# EAGLE schematic overview (EAGLE 6.4)
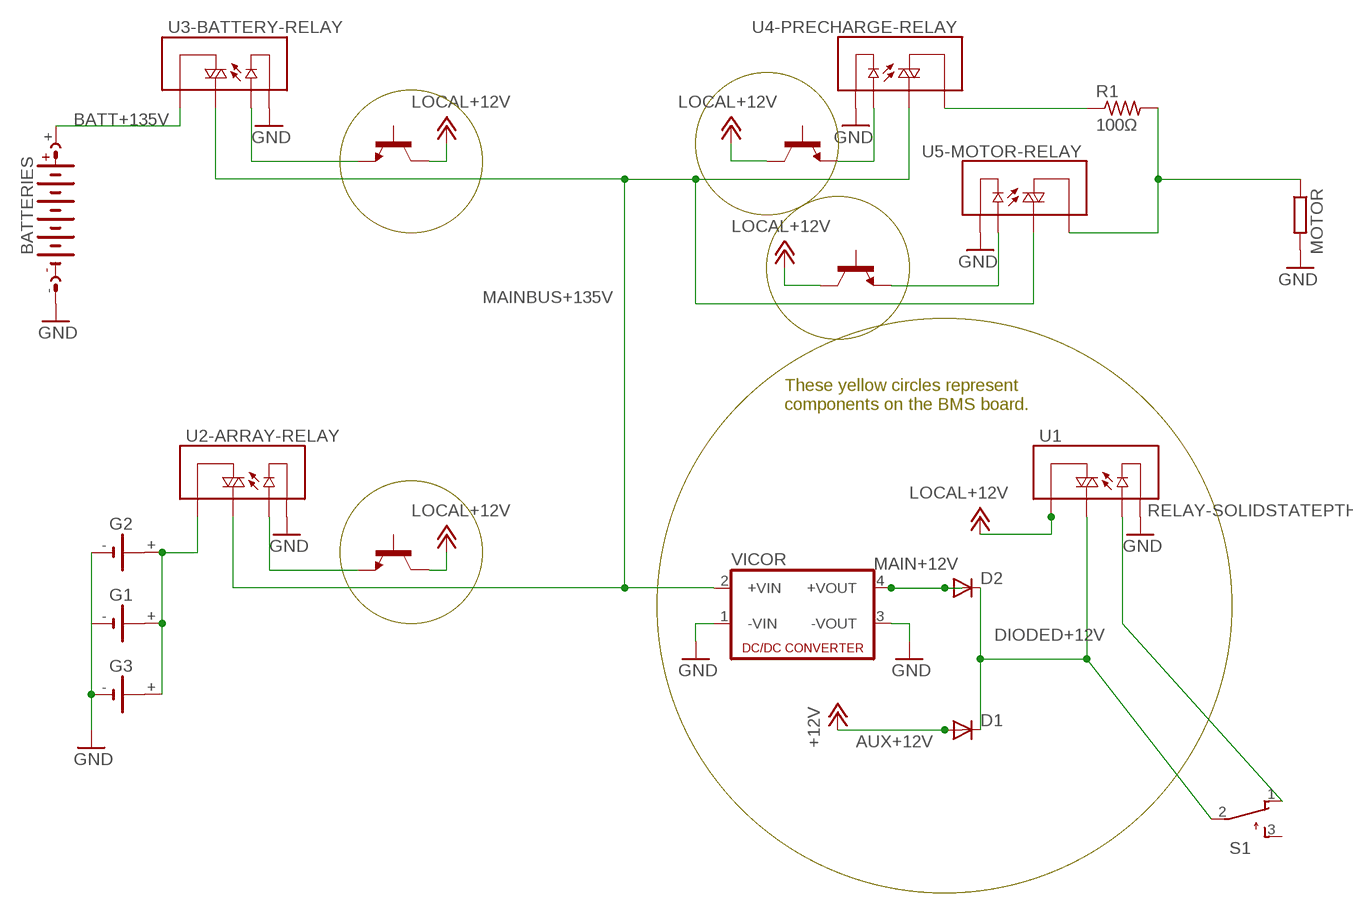
[diagram p0: schematic, sheet 1]

## Parts
BATTERIES  AB9V  [AB9V]
D1  BY550  [DO27-15]
D2  BY550  [DO27-15]
G1  CR03N  [CR03N]
G2  CR03N  [CR03N]
G3  CR03N  [CR03N]
MOTOR  R-EU_0204/7  [0204/7]
R1  100Ω  R-US_0617/22  [0617/22]
S1  TL32PO  [TL3XPO]
T1  2N1613  [TO5]
T2  2N1613  [TO5]
T3  2N1613  [TO5]
T4  2N1613  [TO5]
U1  RELAY-SOLIDSTATEPTH  [RELAY-S108T02]
U2-ARRAY-RELAY  RELAY-SOLIDSTATEPTH  [RELAY-S108T02]
U3-BATTERY-RELAY  RELAY-SOLIDSTATEPTH  [RELAY-S108T02]
U4-PRECHARGE-RELAY  RELAY-SOLIDSTATEPTH  [RELAY-S108T02]
U5-MOTOR-RELAY  RELAY-SOLIDSTATEPTH  [RELAY-S108T02]
VICOR  NME  [NME]

## Nets
AUX+12V: D1.A ; supply symbol labelled +12V
BATT+135V: BATTERIES.+ U3-BATTERY-RELAY.1(T1)
DIODED+12V: D1.C D2.C S1.2(P) U1.2(T2)
GND: BATTERIES.- G2.- G3.- MOTOR.2 U1.4(-) U2-ARRAY-RELAY.4(-) U3-BATTERY-RELAY.4(-) U4-PRECHARGE-RELAY.4(-) U5-MOTOR-RELAY.4(-) VICOR.1(-VIN) VICOR.3(-VOUT)
LOCAL+12V: T1.1(E) T1.3(C) T2.1(E) T2.3(C) T3.1(E) T3.3(C) T4.3(C) U1.1(T1) U2-ARRAY-RELAY.3(+) U3-BATTERY-RELAY.3(+) U4-PRECHARGE-RELAY.3(+) ; supply symbol labelled +12V
MAIN+12V: D2.A VICOR.4(+VOUT)
MAINBUS+135V: U2-ARRAY-RELAY.2(T2) U3-BATTERY-RELAY.2(T2) U4-PRECHARGE-RELAY.2(T2) U5-MOTOR-RELAY.2(T2) VICOR.2(+VIN)
N$2: S1.1(O) U1.3(+)
N$3: R1.1 U4-PRECHARGE-RELAY.1(T1)
N$4: MOTOR.1 R1.2 U5-MOTOR-RELAY.1(T1)
N$6: G1.+ G2.+ G3.+ U2-ARRAY-RELAY.1(T1)
N$7: T4.1(E) U5-MOTOR-RELAY.3(+)
Unconnected: G1.+@1(+) G1.- G2.+@1(+) G3.+@1(+) S1.3(S) T1.2(B) T2.2(B) T3.2(B) T4.2(B)

## Notes on the sheet
- These yellow circles represent
  components on the BMS board.

## Library data of the parts
BATTERIES = battery:AB9V: 9-V BATTERY CLIP
D1 D2 = diode:BY550: DIODE Si200 V, 5 A
G1-G3 = battery:CR03N: LI BATTERY Sonnenschein
MOTOR = resistor:R-EU_: RESISTOR, European symbol
R1 = resistor:R-US_: RESISTOR, American symbol
S1 = switch:TL32PO: TINY SWITCH ON - MOM Source: http://www2.produktinfo.conrad.com/datenblaetter/700000-724999/705152-da-01-de-Subminiaturschalter_TL_36YO.pdf
T1-T4 = transistor:2N1613: NPN TRANSISTOR
U1 U2-ARRAY-RELAY U3-BATTERY-RELAY U4-PRECHARGE-RELAY U5-MOTOR-RELAY = SparkFun-Electromechanical:RELAY-SOLIDSTATE: SPST SS relay
VICOR = dc-dc-converter:NME: DC-DC CONVERTER; MF: C & D TECHNOLOGIES, INC; MPN: NME1205D; OC_FARNELL: 1021466; OC_NEWARK: 98B8198